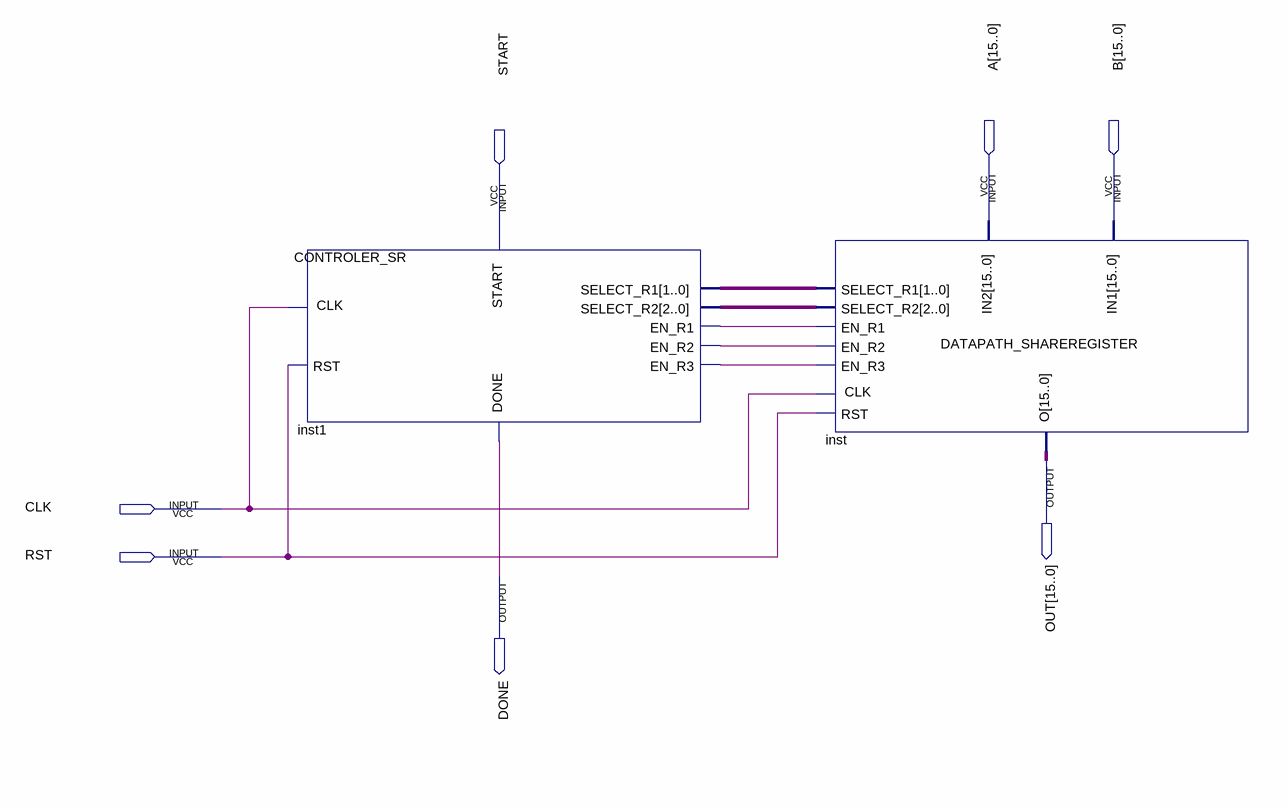
[diagram p0: schematic sheet]
// Quartus schematic SRA_SHARE_REGISTER.bdf as structural Verilog: 2 symbols, 7 pins
module SRA_SHARE_REGISTER (
  input  [15:0] A,
  input  [15:0] B,
  input  START,
  input  CLK,
  input  RST,
  output [15:0] OUT,
  output DONE
);

  wire inst1_en_r1, inst1_en_r2, inst1_en_r3;
  wire [1:0] inst1_select_r1;
  wire [2:0] inst1_select_r2;

  CONTROLER_SR inst1 (
    .START(START), .CLK(CLK), .RST(RST), .SELECT_R1(inst1_select_r1), .SELECT_R2(inst1_select_r2),
    .EN_R1(inst1_en_r1), .EN_R2(inst1_en_r2), .EN_R3(inst1_en_r3), .DONE(DONE));
  DATAPATH_SHAREREGISTER inst (
    .SELECT_R1(inst1_select_r1), .SELECT_R2(inst1_select_r2), .EN_R1(inst1_en_r1), .EN_R2(inst1_en_r2),
    .EN_R3(inst1_en_r3), .IN1(B), .IN2(A), .RST(RST), .CLK(CLK), .O(OUT));
endmodule
